# Altium schematic sheet Multisheet.SchDoc
size A4
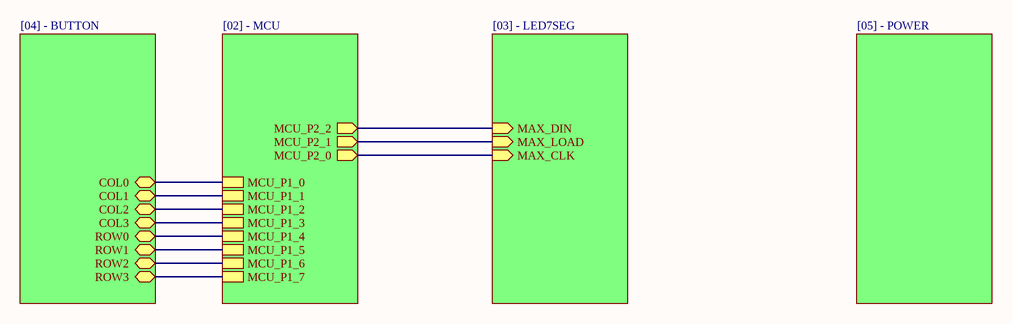
[diagram p0: Multisheet.SchDoc]

## Sub-sheets
0 = [04] - BUTTON: COL0 (bidir), COL1 (bidir), COL2 (bidir), COL3 (bidir), ROW0 (bidir), ROW1 (bidir), ROW3 (bidir), ROW2 (bidir)
1 = [02] - MCU: MCU_P2_2 (out), MCU_P2_1 (out), MCU_P2_0 (out), MCU_P1_0, MCU_P1_7, MCU_P1_1, MCU_P1_2, MCU_P1_4, MCU_P1_3, MCU_P1_5, MCU_P1_6
2 = [03] - LED7SEG: MAX_DIN (in), MAX_LOAD (in), MAX_CLK (in)
3 = [05] - POWER: no entries

## Nets
(unnamed): sheet 1/MCU_P2_2, sheet 2/MAX_DIN
(unnamed): sheet 1/MCU_P2_1, sheet 2/MAX_LOAD
(unnamed): sheet 1/MCU_P2_0, sheet 2/MAX_CLK
(unnamed): sheet 1/MCU_P1_0, sheet 0/COL0
(unnamed): sheet 1/MCU_P1_7, sheet 0/ROW3
(unnamed): sheet 1/MCU_P1_1, sheet 0/COL1
(unnamed): sheet 1/MCU_P1_2, sheet 0/COL2
(unnamed): sheet 1/MCU_P1_4, sheet 0/ROW0
(unnamed): sheet 1/MCU_P1_3, sheet 0/COL3
(unnamed): sheet 1/MCU_P1_5, sheet 0/ROW1
(unnamed): sheet 1/MCU_P1_6, sheet 0/ROW2